# Altium schematic sheet PHP.SchDoc
size A; SheetNumber: 2; SheetTotal: 2
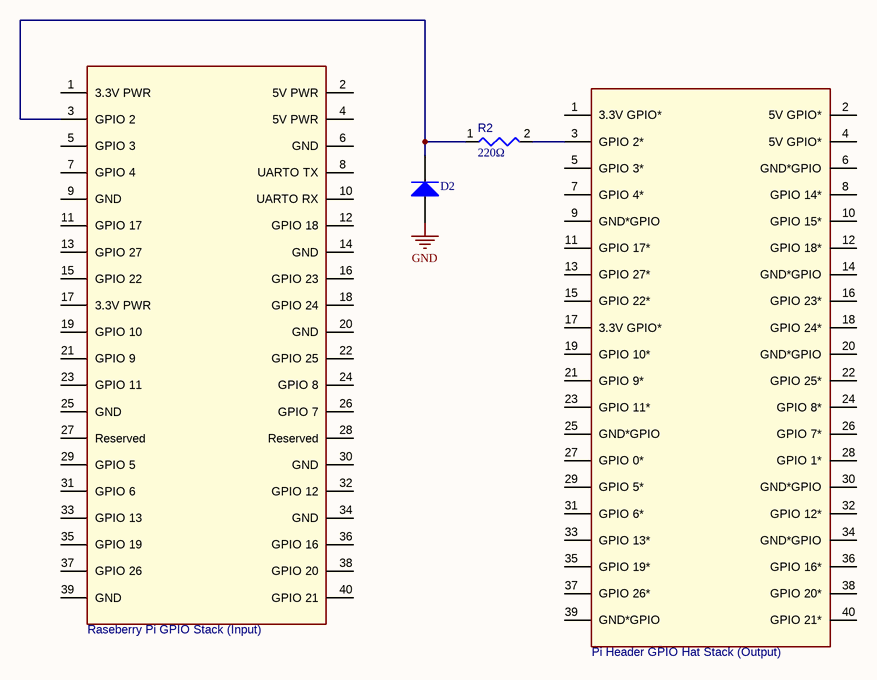
[diagram p0: PHP.SchDoc]

## Parts
D2  1N4148  [NXP-SOD27-2_V]  (value not drawn)
J1  Raseberry Pi GPIO Stack (Input)  [TECO-1746540-4_V]
J2  Pi Header GPIO Hat Stack (Output)  [TECO-1746540-4_V]  (part B of 2)
R2  220Ω  [RESC1608X55X25ML10T15]

## Nets
GND: D2.1(A)
NetD2_2: D2.2(K) J1.3(GPIO_2) R2.1
NetJ2_3: J2.3(GPIO_2*) R2.2

Not connected (* = marked no-connect by the designer): J1 1(3.3V_PWR) 2(5V_PWR) 4(5V_PWR) 5(GPIO_3) 6(GND) 7(GPIO_4) 8(UARTO_TX) 9(GND) 10(UARTO_RX) 11(GPIO_17) 12(GPIO_18) 13(GPIO_27) 14(GND) 15(GPIO_22) 16(GPIO_23) 17(3.3V_PWR) 18(GPIO_24) 19(GPIO_10) 20(GND) 21(GPIO_9) 22(GPIO_25) 23(GPIO_11) 24(GPIO_8) 25(GND) 26(GPIO_7) 27(Reserved) 28(Reserved) 29(GPIO_5) 30(GND) 31(GPIO_6) 32(GPIO_12) 33(GPIO_13) 34(GND) 35(GPIO_19) 36(GPIO_16) 37(GPIO_26) 38(GPIO_20) 39(GND) 40(GPIO_21); J2 1(3.3V_GPIO*) 2(5V_GPIO*) 4(5V_GPIO*) 5(GPIO_3*) 6(GND*GPIO) 7(GPIO_4*) 8(GPIO_14*) 9(GND*GPIO) 10(GPIO_15*) 11(GPIO_17*) 12(GPIO_18*) 13(GPIO_27*) 14(GND*GPIO) 15(GPIO_22*) 16(GPIO_23*) 17(3.3V_GPIO*) 18(GPIO_24*) 19(GPIO_10*) 20(GND*GPIO) 21(GPIO_9*) 22(GPIO_25*) 23(GPIO_11*) 24(GPIO_8*) 25(GND*GPIO) 26(GPIO_7*) 27(GPIO_0*) 28(GPIO_1*) 29(GPIO_5*) 30(GND*GPIO) 31(GPIO_6*) 32(GPIO_12*) 33(GPIO_13*) 34(GND*GPIO) 35(GPIO_19*) 36(GPIO_16*) 37(GPIO_26*) 38(GPIO_20*) 39(GND*GPIO) 40(GPIO_21*)

## Library data of the parts
D2 = CMP-004-00000-2: High Speed Diode, 100 V, 0.45 A, -65 to 175 degC, 2-Pin SOD27, RoHS, Bulk; Manufacturer: Fairchild; Elements: 1; Recovery Time: 4ns; Forward Current: 300mA; Power: 500mW; Forward Voltage: 1V; Max Surge Current: 4A; Peak Reverse Current: 5uA; Datasheet URL: http://www.nxp.com/documents/data_sheet/1N4148_1N4448.pdf; Min Operating Temperature: -65°C; Manufacturer URL: https://www.fairchildsemi.com/; Packaging: Bulk; Diameter: 1.91mm; Pins: 2; Package URL: http://www.nxp.com/documents/data_sheet/1N4148_1N4448.pdf; Package Reference: SOD27; Max Operating Temperature: 175°C; Package Quantity: 2000; Case/Package: DO; Datasheet Version: Aug-04; RoHS Compliant: True
J1 J2 = CMP-02187-7: Connector
R2 = CMP-009-00031-5: Chip Resistor, 4.7 KOhm, +/- 1%, 0.1 W, -55 to 155 degC, 0603 (1608 Metric); Power: 100mW; Tolerance: 1%; Mounting Technology: SM; Case/Package: 0603; Value: 220Ω; RoHS Compliant: True; Pins: 2; Min Operating Temperature: -55°C; Max Operating Temperature: 155°C